# EAGLE design USB Power Switcher (EAGLE 6.2)
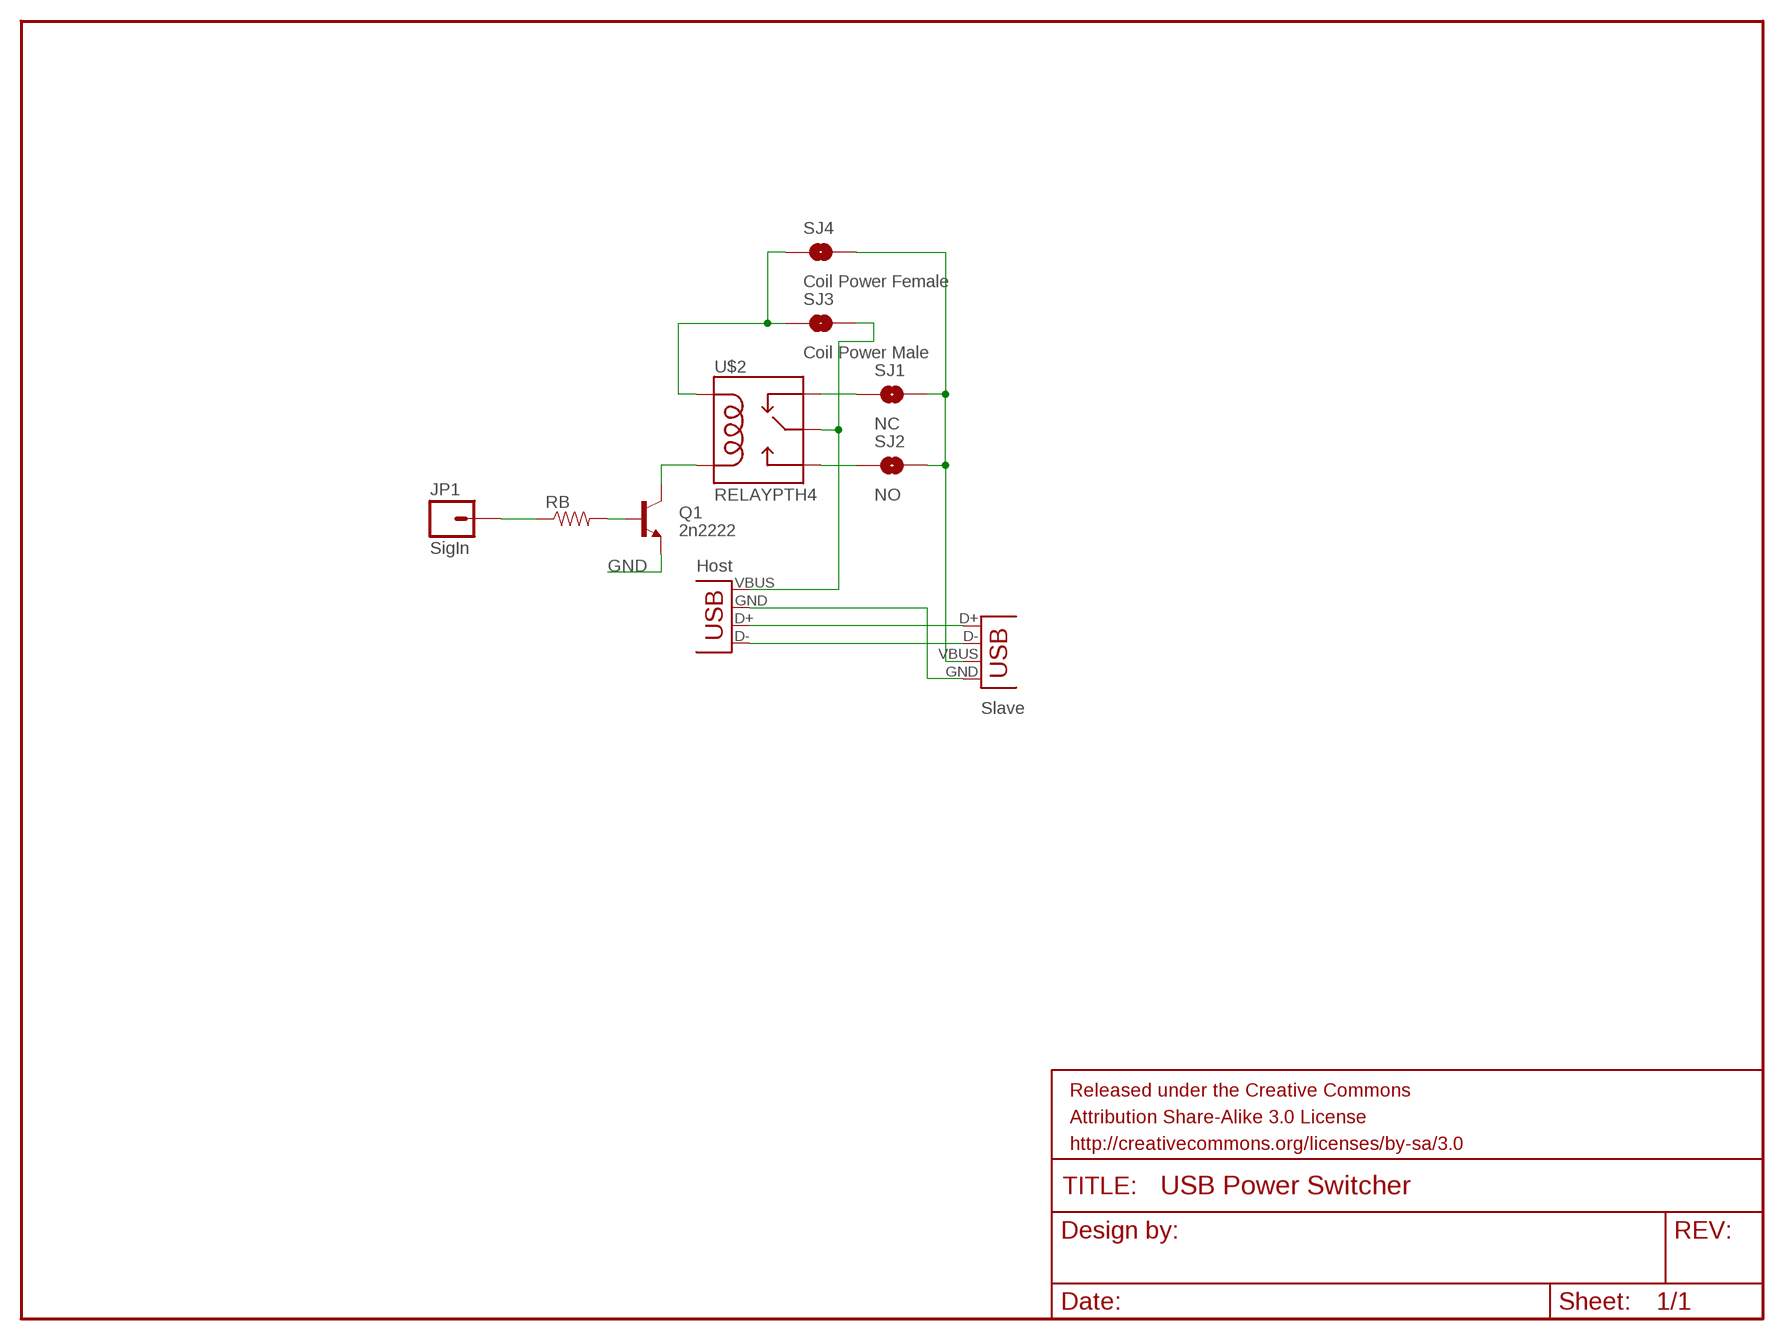
[diagram p0: schematic, sheet 1]

## Parts
JP1  SigIn  M01PTH  [1X01]
Q1  2n2222  TRANSISTOR_NPNTO-92-AMMO  [TO-92-AMMO]
RB  RESISTORAXIAL-0.3  [AXIAL-0.3]
SJ1  NC  SOLDERJUMPERBIGNC  [SJ_2S_BIG]
SJ2  NO  SOLDERJUMPERBIGNC  [SJ_2S_BIG]
SJ3  Coil Power Male  SOLDERJUMPERNO  [SJ_2S-NO]
SJ4  Coil Power Female  SOLDERJUMPERNO  [SJ_2S-NO]
U$2  RELAYPTH4  [RELAY-JZC]
X1  USB-A-SMD  [USB-A-S-NOSILK-FEMALE]
X2  USB-A-H  [USB-A-H]

## Nets
DM: X1.D- X2.D-(D+)
DP: X1.D+ X2.D+(D-)
GND: Q1.1(E) X1.GND X2.GND(VBUS)
N$1: SJ3.1 SJ4.1 U$2.5(COIL1)
N$2: Q1.3(C) U$2.1(COIL2)
N$3: Q1.2(B) RB.P$2
N$4: JP1.1 RB.P$1
N$5: SJ2.1 U$2.3(NO)
N$6: SJ1.1 U$2.2(NC)
VBHOST: SJ3.2 U$2.4(MAIN) X2.VBUS(GND)
VBSLAVE: SJ1.2 SJ2.2 SJ4.2 X1.VBUS

## Notes on the sheet
- Host
- Slave

## Library data of the parts
JP1 = SparkFun-Connectors:M01: Header 1 Standard 1-pin 0.1" header. Use with straight break away headers (SKU : PRT-00116), right angle break away headers (PRT-00553), swiss pins (PRT-00743), machine pins (PRT-00117), and female headers (PRT-00115).
Q1 = SparkFun-DiscreteSemi:TRANSISTOR_NPN: Generic NPN BJT. MMBT2222 is the common NPN we use. Double check against datasheet- not all devices are the same!
RB = SparkFun-Passives:RESISTOR: Resistor Basic schematic elements and footprints for 0603, 1206, and PTH resistors.
SJ1-SJ4 = BUBB-Eagle-Library:SOLDERJUMPER: Solder Jumper Standard SMD solder jumper. Used to automate production. Two varients : Normally Open and Normally Closed are the same, but have different paste layers. NC will have a large amount of paste and should jumper during reflow.
U$2 = SparkFun-Electromechanical:RELAY: SPDT relay (COM-00101)
X1 X2 = SparkFun-Connectors:USB: USB Connectors USB-B-PTH is fully proven SKU : PRT-00139 USB-miniB is fully proven SKU : PRT-00587 USB-A-PCB is untested. USB-A-H is throughly reviewed, but untested. Spark Fun Electronics SKU : PRT-00437 USB-B-SMT is throughly reviewed, but untested. Needs silkscreen touching up. USB-A-S has not been used/tested USB-MB-H has not been used/tested

## Board
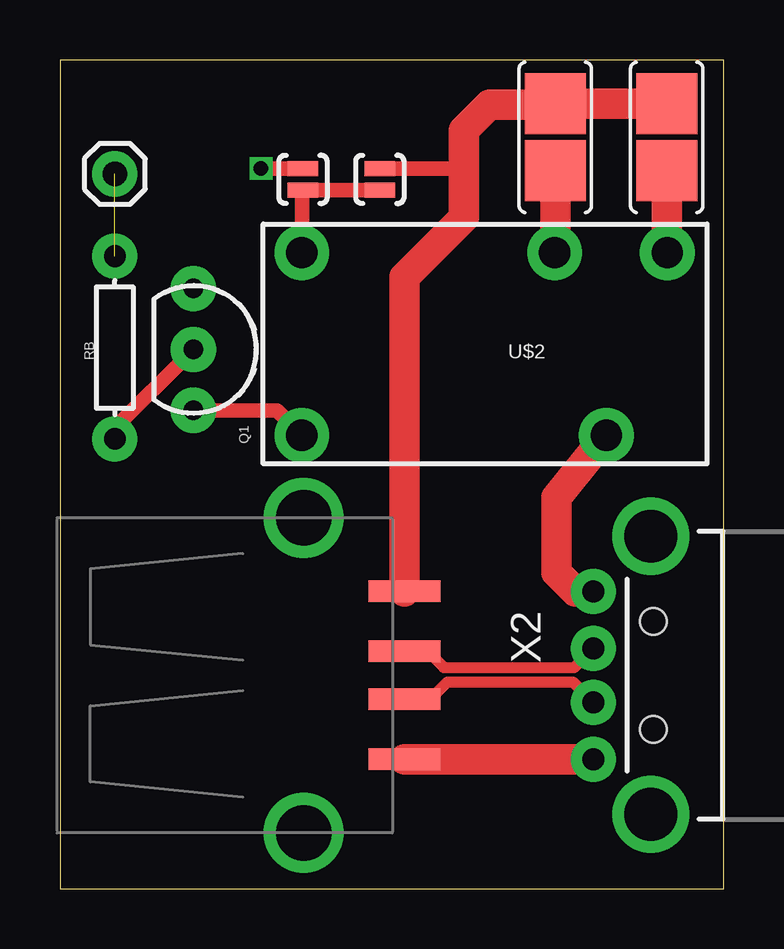
[diagram p1: board, top side]
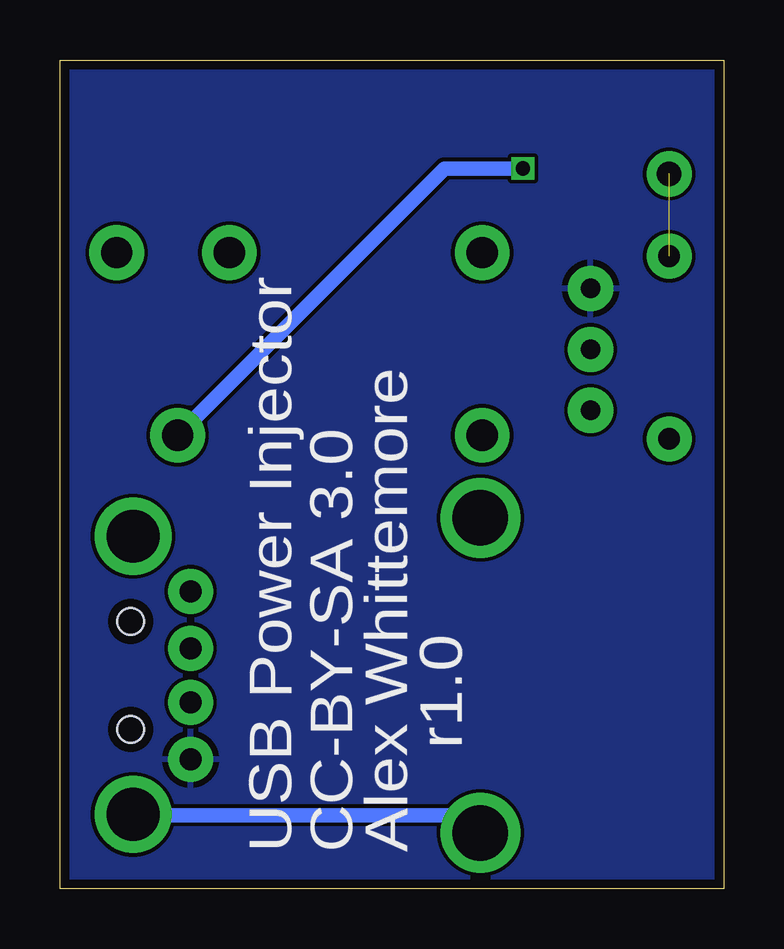
[diagram p2: board, bottom side, seen from below]

Size 27.69 x 34.54 mm. Coordinates in mm from the lower left corner, seen from the top.
Outline: 0,0 27.69,0 27.69,34.54 0,34.54 0,0
Copper layers (1*16): Top 0.0356mm / dielectric 1.5011mm / Bottom 0.0356mm
Design rules: minimum track width 6mil, minimum drill 13mil, track to track 6mil, track to pad 6mil, pad to pad 6mil, via to via 6mil, smd to smd 6mil, copper to edge 15mil, drill to drill 6mil, minimum pad ring 7mil, minimum via ring 7mil, stop-mask expansion 4mil, vias tented up to drill 0mil, thermal gap 10mil

### Footprints (pad centres in the part's own frame; a part is rotated, then mirrored left to right if it is on the bottom)
1X01 = drill 1.016 pad 1.88: 1 0,0
TO-92-AMMO = drill 0.813 pad 1.88: 1 -2.54,0; 2 0,0; 3 2.54,0
AXIAL-0.3 = drill 0.9 pad 1.88: P$1 -3.81,0; P$2 3.81,0
SJ_2S_BIG = smd 2.54 x 2.54: 1 -1.397,0; 2 1.397,0
SJ_2S-NO = smd 0.635 x 1.27: 1 -0.45,0; 2 0.45,0
RELAY-JZC = drill 1.3 pad 2.286: 1 3.81,-8.89; 2 -3.81,1.651; 3 -3.81,6.35; 4 3.81,3.81; 5 -3.81,-8.89
USB-A-S-NOSILK-FEMALE = smd 3 x 0.9: D+ 4.212,-1; D- 4.212,1; GND 4.212,-3.5; VBUS 4.212,3.5 | drill 2.311: P$5 0,-6.566; P$6 0,6.566
USB-A-H = drill 0.914 pad 1.88: D+ 2.4,1.127; D- 2.4,-1.127; GND 2.4,3.5; VBUS 2.4,-3.5 | drill 2.2: GND2 0,-5.8; GND3 0,5.8 | hole 1.1: -0.1,2.25; -0.1,-2.25

### Placement (x,y rotation side)
JP1  2.29,29.79 90 top
Q1  5.56,22.48 270 top
RB  2.29,22.56 270 top
SJ1  20.65,31.32 90 top
SJ2  25.3,31.32 90 top
SJ3  10.13,29.57 90 top
SJ4  13.34,29.57 90 top
U$2  18.97,22.71 270 top
X1  10.16,8.89 0 top
X2  24.64,8.89 180 top

### Tracks (layer width: path | path; a pad name or v marks a point on that pad's centre or on a via)
DM
  Top 0.457: X1.D- 15.48,9.89 15.48,9.74 16,9.22 21.44,9.22 X2.D-
DP
  Top 0.457: X1.D+ 15.43,7.89 16.15,8.61 21.39,8.61 X2.D+
GND
  Top 1.27: X1.GND X2.GND
  pour Bottom: 0,0 0.25,34.54 27.69,34.54 27.69,0
N$1
  Top 0.61: U$2.5 10.08,29.07 SJ3.1 SJ4.1
N$2
  Top 0.61: Q1.3 9.04,19.94 U$2.1
N$3
  Top 0.61: RB.P$2 2.16,19.07 Q1.2
N$4  (1 unrouted)
N$5
  Top 1.27: SJ2.1 25.3,26.54 U$2.3
N$6
  Top 1.27: SJ1.1 20.65,26.54 U$2.2
SHELL
  Bottom 0.61: 10.16,2.29 10.16,3.05 24.64,3.05
VBHOST  (via drill 0.6)
  Top 0.61: SJ3.2 v8.39,30.02 v8.38,30.02
  Top 1.27: X2.VBUS 21.49,12.39 20.7,13.18 20.7,16.31 U$2.4
  Bottom 0.61: v8.38,30.02 11.66,30.02 U$2.4
VBSLAVE
  Top 0.61: SJ4.2 16.68,30.02 16.84,30.18
  Top 1.27: X1.VBUS 14.37,25.5 16.84,27.96 16.84,30.18 16.84,31.62 17.91,32.69 20.62,32.69 SJ1.2 SJ2.2

### Text on the board
bPlace: r1.0 | Alex Whittemore | CC-BY-SA 3.0 | USB Power Injector